# EAGLE design MainBoard (EAGLE 8.2.2)
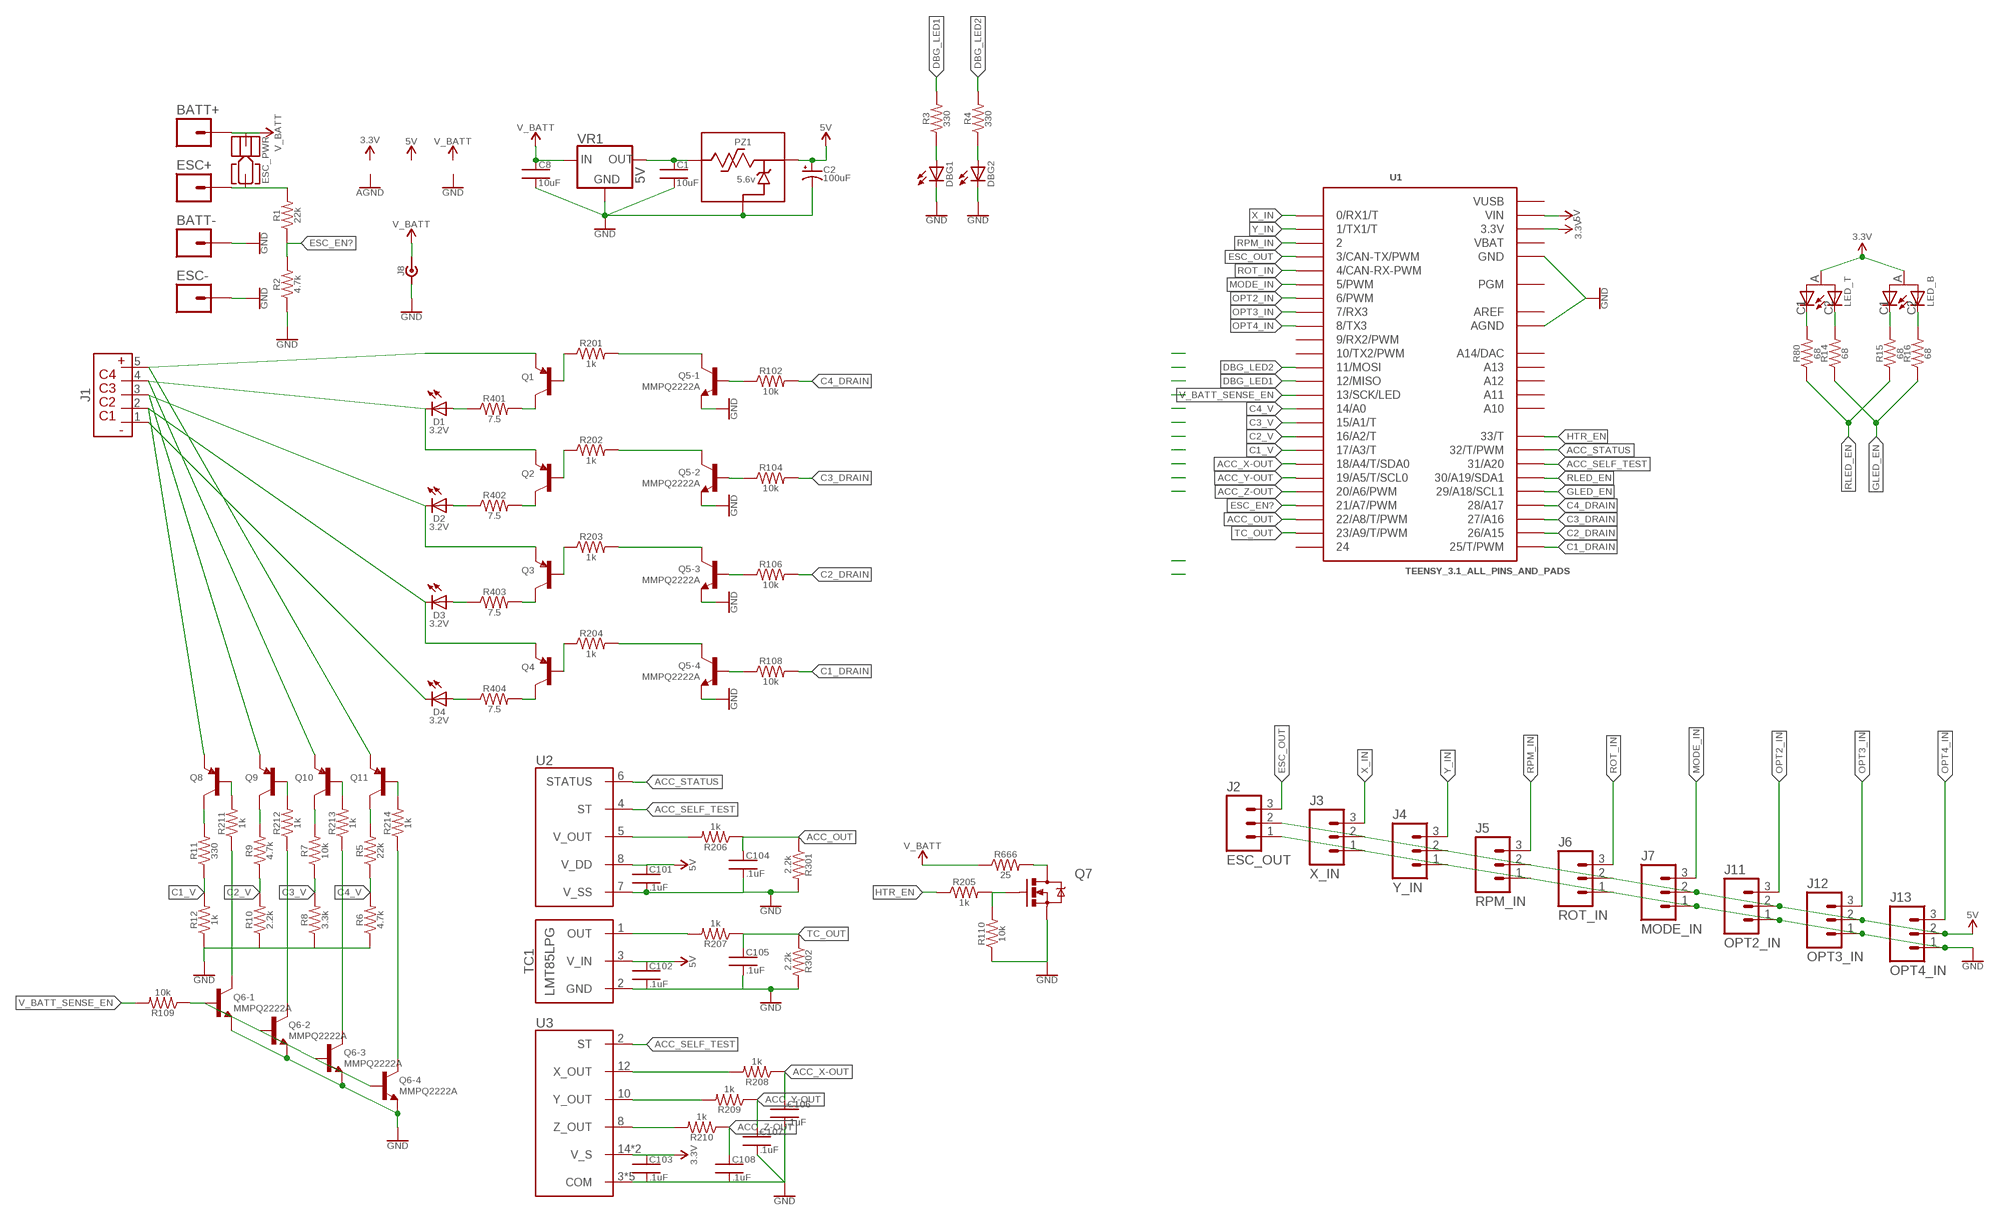
[diagram p0: schematic, sheet 1]

## Parts
BATT+  14AWG  [14AWG_SMD]
BATT-  14AWG  [14AWG_SMD]
C1  10uF  CAP_SMD  [0805]
C2  100uF  CAP_POL_SMD  [2917_D-CASE]
C8  10uF  CAP_SMD  [0805]
C101  .1uF  CAP_SMD  [0805]
C102  .1uF  CAP_SMD  [0805]
C103  .1uF  CAP_SMD  [0805]
C104  .1uF  CAP_SMD  [0805]
C105  .1uF  CAP_SMD  [0805]
C106  .1uF  CAP_SMD  [0805]
C107  .1uF  CAP_SMD  [0805]
C108  .1uF  CAP_SMD  [0805]
D1  3.2V  LED2835  [LED-2835]
D2  3.2V  LED2835  [LED-2835]
D3  3.2V  LED2835  [LED-2835]
D4  3.2V  LED2835  [LED-2835]
DBG1  LED1206  [LED-1206]
DBG2  LED1206  [LED-1206]
ESC+  14AWG  [14AWG_SMD]
ESC-  14AWG  [14AWG_SMD]
ESC_PWR  JACK_PWR_SCREW  [JACK_PWR_SCREW]
J1  BATT_BALANCER_PLUG_4S  [JST_MALE_5_PIN]
J2  ESC_OUT  M03  [1X03]
J3  X_IN  M03  [1X03]
J4  Y_IN  M03  [1X03]
J5  RPM_IN  M03  [1X03]
J6  ROT_IN  M03  [1X03]
J7  MODE_IN  M03  [1X03]
J8  PJ-082BH  [PJ-082BH]
J11  OPT2_IN  M03  [1X03]
J12  OPT3_IN  M03  [1X03]
J13  OPT4_IN  M03  [1X03]
LED_B  DIALIGHT_597-2751-607F  [DIALIGHT_1208_BI-COLOR]
LED_T  DIALIGHT_597-2751-607F  [DIALIGHT_1208_BI-COLOR]
PZ1  5.6v  POLYZEN_LS  [POLYZEN_LS]
Q1  BJT_PNP  [SOT23-3]
Q2  BJT_PNP  [SOT23-3]
Q3  BJT_PNP  [SOT23-3]
Q4  BJT_PNP  [SOT23-3]
Q5  MMPQ2222A  [SOIC_16]
Q6  MMPQ2222A  [SOIC_16]
Q7  MOSFET_N-CHANNEL_SOT23-3  [SOT23-3]
Q8  BJT_PNP  [SOT23-3]
Q9  BJT_PNP  [SOT23-3]
Q10  BJT_PNP  [SOT23-3]
Q11  BJT_PNP  [SOT23-3]
R1  22k  RES_SMD0805  [0805]
R2  4.7k  RES_SMD0805  [0805]
R3  330  RES_SMD0805  [0805]
R4  330  RES_SMD0805  [0805]
R5  22k  RES_SMD0805  [0805]
R6  4.7k  RES_SMD0805  [0805]
R7  10k  RES_SMD0805  [0805]
R8  3.3k  RES_SMD0805  [0805]
R9  4.7k  RES_SMD0805  [0805]
R10  2.2k  RES_SMD0805  [0805]
R11  330  RES_SMD0805  [0805]
R12  1k  RES_SMD0805  [0805]
R14  68  RES_SMD0805  [0805]
R15  68  RES_SMD0805  [0805]
R16  68  RES_SMD0805  [0805]
R80  68  RES_SMD0805  [0805]
R102  10k  RES_SMD0805  [0805]
R104  10k  RES_SMD0805  [0805]
R106  10k  RES_SMD0805  [0805]
R108  10k  RES_SMD0805  [0805]
R109  10k  RES_SMD0805  [0805]
R110  10k  RES_SMD0805  [0805]
R201  1k  RES_SMD0805  [0805]
R202  1k  RES_SMD0805  [0805]
R203  1k  RES_SMD0805  [0805]
R204  1k  RES_SMD0805  [0805]
R205  1k  RES_SMD0805  [0805]
R206  1k  RES_SMD0805  [0805]
R207  1k  RES_SMD0805  [0805]
R208  1k  RES_SMD0805  [0805]
R209  1k  RES_SMD0805  [0805]
R210  1k  RES_SMD0805  [0805]
R211  1k  RES_SMD0805  [0805]
R212  1k  RES_SMD0805  [0805]
R213  1k  RES_SMD0805  [0805]
R214  1k  RES_SMD0805  [0805]
R301  2.2k  RES_SMD0805  [0805]
R302  2.2k  RES_SMD0805  [0805]
R401  7.5  RES_SMD1206  [1206]
R402  7.5  RES_SMD1206  [1206]
R403  7.5  RES_SMD1206  [1206]
R404  7.5  RES_SMD1206  [1206]
R666  25  AP851  [TO-220-R]
TC1  LMT85LPG  [TO-92]
U1  TEENSY_3.1_ALL_PINS_AND_PADS  [TEENSY_3.1_ALLPINS]
U2  MMA1211KEG  [SOIC_16_WIDE]
U3  ADXL326  [LFCSP_LQ]
VR1  5V  TSR_2-XXXX  [TSR_2-XXXX]

## Nets
3.3V: C103.1 LED_B.A LED_T.A U1.3.3V U1.3.3V1(3.3V) U1.3.3V2(3.3V) U3.14(V_S) U3.15(V_S)
5V: C2.A+(+) C101.1 C102.1 J2.2 J3.2 J4.2 J5.2 J6.2 J7.2 J11.2 J12.2 J13.2 PZ1.VOUT(V_OUT) TC1.3(V_IN) U1.VIN U2.8(V_DD)
ACC_OUT: C104.1 R206.1 R301.1 U1.22/A8(22/A8/T/PWM)
ACC_SELF_TEST: U1.31(31/A20) U2.4(ST) U3.2(ST)
ACC_STATUS: U1.32(32/T/PWM) U2.6(STATUS)
ACC_X-OUT: C106.1 R208.1 U1.18/A4(18/A4/T/SDA0)
ACC_Y-OUT: C107.1 R209.1 U1.19/A5(19/A5/T/SCL0)
ACC_Z-OUT: C108.1 R210.1 U1.20/A6(20/A6/PWM)
C1_DRAIN: R108.2 U1.25(25/T/PWM)
C1_V: R11.1 R12.2 U1.17/A3(17/A3/T)
C2_DRAIN: R106.2 U1.26(26/A15)
C2_V: R9.1 R10.2 U1.16/A2(16/A2/T)
C3_DRAIN: R104.2 U1.27(27/A16)
C3_V: R7.1 R8.2 U1.15/A1(15/A1/T)
C4_DRAIN: R102.2 U1.28(28/A17)
C4_V: R5.1 R6.2 U1.14/A0
DBG_LED1: R3.2 U1.12(12/MISO)
DBG_LED2: R4.2 U1.11(11/MOSI)
ESC+: ESC+.P ESC_PWR.1 R1.2
ESC_EN?: R1.1 R2.2 U1.21/A7(21/A7/PWM)
ESC_OUT: J2.3 U1.3(3/CAN-TX/PWM)
GLED_EN: R14.1 R16.1 U1.29(29/A18/SCL1)
GND: BATT-.P C1.2 C2.C-(-) C8.2 C101.2 C102.2 C103.2 C104.2 C105.2 C106.2 C107.2 C108.2 DBG1.C DBG2.C ESC-.P J2.1 J3.1 J4.1 J5.1 J6.1 J7.1 J8.2 J8.SH1 J8.SH2 J8.SH3 J8.SH4 J11.1 J12.1 J13.1 PZ1.GND Q5.10(-4:E) Q5.12(-3:E) Q5.14(-2:E) Q5.16(-1:E) Q6.10(-4:E) Q6.12(-3:E) Q6.14(-2:E) Q6.16(-1:E) Q7.2(S) R2.1 R6.1 R8.1 R10.1 R12.1 R110.1 R301.2 R302.2 TC1.2(GND) U1.AGND U1.GND U1.GND1(GND) U1.GND2(GND) U2.7(V_SS) U3.3(COM) U3.5(COM) U3.6(COM) U3.7(COM) U3.17(COM) VR1.2(GND)
HTR_EN: R205.1 U1.33(33/T)
MODE_IN: J7.3 U1.5(5/PWM)
N$1: D1.A R401.1
N$2: Q1.3(C) R401.2
N$3: Q1.1(B) R201.1
N$4: Q5.1(-1:C) Q5.2(-1:C) R201.2
N$5: J1.5(C4) Q1.2(E) Q11.2(E)
N$6: Q5.15(-1:B) R102.1
N$7: Q7.3(D) R666.2
N$8: D2.A R402.1
N$9: Q2.3(C) R402.2
N$10: Q2.1(B) R202.1
N$11: Q5.3(-2:C) Q5.4(-2:C) R202.2
N$12: D1.C J1.4(C3) Q2.2(E) Q10.2(E)
N$13: Q5.13(-2:B) R104.1
N$14: D3.A R403.1
N$15: Q3.3(C) R403.2
N$16: Q3.1(B) R203.1
N$17: Q5.5(-3:C) Q5.6(-3:C) R203.2
N$18: D2.C J1.3(C2) Q3.2(E) Q9.2(E)
N$19: Q5.11(-3:B) R106.1
N$20: D4.A R404.1
N$21: Q4.3(C) R404.2
N$22: Q4.1(B) R204.1
N$23: Q5.7(-4:C) Q5.8(-4:C) R204.2
N$24: D3.C J1.2(C1) Q4.2(E) Q8.2(E)
N$25: Q5.9(-4:B) R108.1
N$26: D4.C J1.1(V0)
N$27: Q7.1(G) R110.2 R205.2
N$28: R206.2 U2.5(V_OUT)
N$29: Q8.3(C) R11.2
N$30: Q8.1(B) R211.2
N$31: Q6.1(-1:C) Q6.2(-1:C) R211.1
N$32: Q9.1(B) R212.2
N$33: Q6.9(-4:B) Q6.11(-3:B) Q6.13(-2:B) Q6.15(-1:B) R109.1
N$34: R208.2 U3.12(X_OUT)
N$35: R209.2 U3.10(Y_OUT)
N$36: R210.2 U3.8(Z_OUT)
N$37: R207.2 TC1.1(OUT)
N$38: Q6.3(-2:C) Q6.4(-2:C) R212.1
N$39: Q10.3(C) R7.2
N$40: Q10.1(B) R213.2
N$41: Q6.5(-3:C) Q6.6(-3:C) R213.1
N$42: Q11.3(C) R5.2
N$43: Q11.1(B) R214.2
N$44: Q6.7(-4:C) Q6.8(-4:C) R214.1
N$45: Q9.3(C) R9.2
N$48: DBG2.A R4.1
N$49: DBG1.A R3.1
N$50: C1.1 PZ1.VIN(V_IN) VR1.3(OUT)
N$62: LED_T.C1 R80.2
N$63: LED_T.C2 R14.2
N$64: LED_B.C1 R15.2
N$65: LED_B.C2 R16.2
OPT2_IN: J11.3 U1.6(6/PWM)
OPT3_IN: J12.3 U1.7(7/RX3)
OPT4_IN: J13.3 U1.8(8/TX3)
RLED_EN: R15.1 R80.1 U1.30(30/A19/SDA1)
ROT_IN: J6.3 U1.4(4/CAN-RX-PWM)
RPM_IN: J5.3 U1.2
TC_OUT: C105.1 R207.1 R302.1 U1.23/A9(23/A9/T/PWM)
V_BATT: BATT+.P C8.1 ESC_PWR.2 J8.1 R666.1 VR1.1(IN)
V_BATT_SENSE_EN: R109.2 U1.13(13/SCK/LED)
X_IN: J3.3 U1.0(0/RX1/T)
Y_IN: J4.3 U1.1(1/TX1/T)
Unconnected: U1.9(9/RX2/PWM) U1.10(10/TX2/PWM) U1.24 U1.A10 U1.A11 U1.A12 U1.A13 U1.A14(A14/DAC) U1.PGM

## Power pins joined to a net without a drawn wire
AREF: U1.AREF
VBAT: U1.VBAT
VUSB: U1.VUSB

## Library data of the parts
BATT+ BATT- ESC+ ESC- = jack_connector:14AWG
C1 C8 C101-C108 = jack_RCL:CAP_SMD
C2 = jack_RCL:CAP_POL_SMD
D1-D4 DBG1 DBG2 = jack_led:LED
ESC_PWR = jack_connector:JACK_PWR_SCREW
J1 = jack_connector:BATT_BALANCER_PLUG_4S
J2-J7 J11-J13 = jack_connector:M03
J8 = jack_connector:PJ-082BH: 2.5mm X 5.5mm Barrel Jack 10A https://www.mouser.com/productdetail/cui/pj-082bh?qs=sGAEpiMZZMtnOp%252bbbqA009lE0K0K%252bPZGlcfi0IIywdBXw6pUdVh2jw%3D%3D
LED_B LED_T = jack_led:DIALIGHT_597-2751-607F
PZ1 = jack_IC:POLYZEN: https://www.mouser.com/ds/2/240/Littelfuse_PolyZen_Standard_PolyZen_Catalog_Datash-1021770.pdf
Q1-Q4 Q8-Q11 = jack_semi:BJT_PNP: Generic NPN Bipolar transistor
Q5 Q6 = jack_semi:MMPQ2222A: Quad 500mA 40v NPN transistor package https://www.mouser.com/productdetail/on-semiconductor-fairchild/mmpq2222a?qs=sGAEpiMZZMshyDBzk1%2FWi8oN7VHZ91Okw9HzP%2FjA8dg%3D
Q7 = jack_semi:MOSFET_N-CHANNEL
R1-R12 R14-R16 R80 R102 R104 R106 R108-R110 R201-R214 R301 R302 R401-R404 = jack_RCL:RES_SMD
R666 = jack_RCL:AP851: TO-220 50W Resistor http://www.mouser.com/ds/2/303/acl_ap851-1228646.pdf
TC1 = jack_IC:LMT85: LMT85 Analog Temperature Sensor -50C to 150C, 1.8V-5.5V Vin Texas Instruments http://www.ti.com/lit/ds/symlink/lmt85.pdf
U1 = jack_IC:TEENSY_3.1_ALL_PINS_AND_PADS: Footprint for Teensy 3.1 board using all pads and all through-holes. Pads need a 2x7 0.1" SMD header.
U2 = jack_IC:MMA1211KEG
U3 = jack_IC:ADXL326
VR1 = jack_IC:TSR_2-XXXX: TRACO Power 2A step down converter http://www.mouser.com/ds/2/687/tsr2-datasheet-911338.pdf

## Board
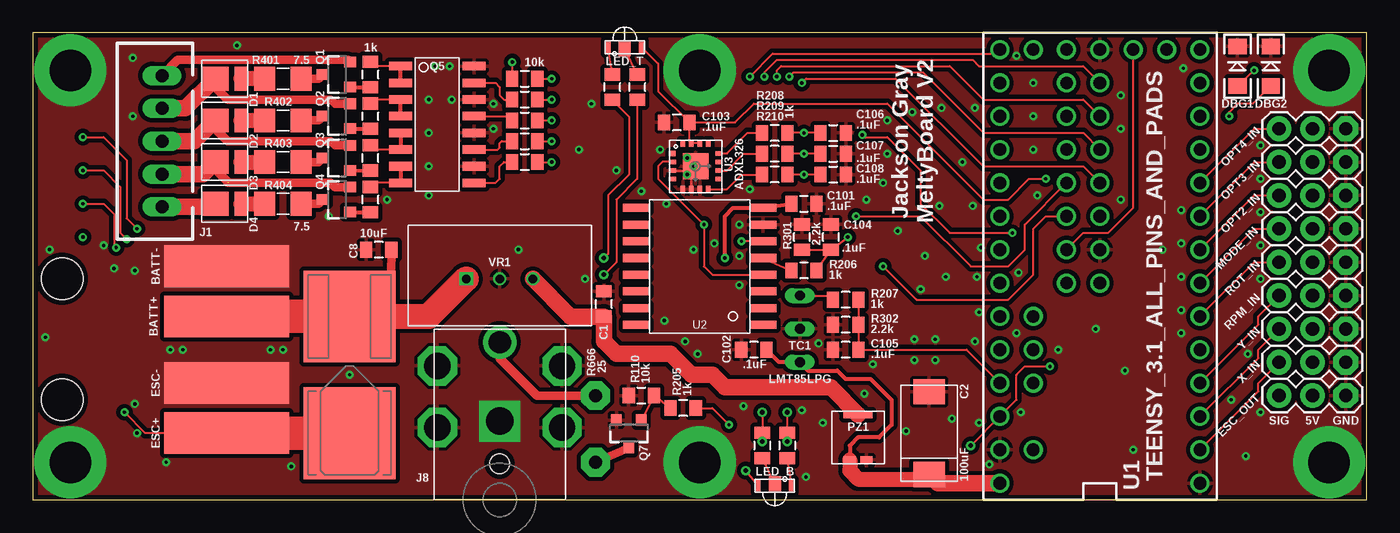
[diagram p1: board, top side]
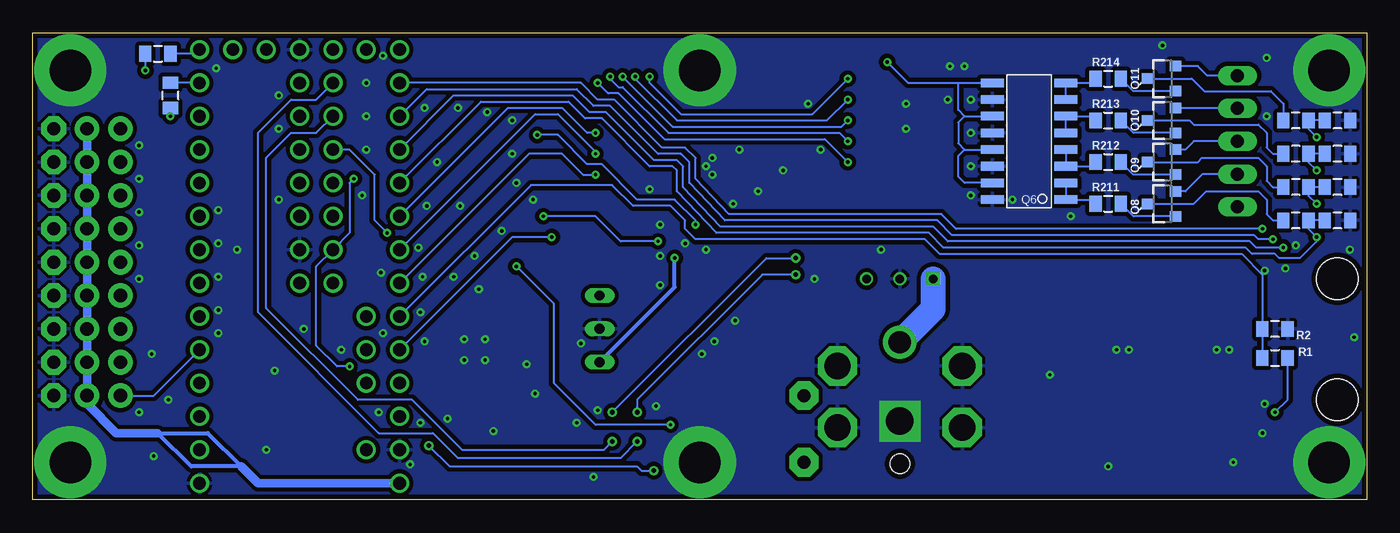
[diagram p2: board, bottom side, seen from below]

Size 101.6 x 35.56 mm. Coordinates in mm from the lower left corner, seen from the top.
Outline: 0,0 101.6,0 101.6,35.56 0,35.56 0,0
Copper layers (1*16): Top 0.0356mm / dielectric 1.5011mm / Bottom 0.0356mm
Design rules "oshpark-2layer *": minimum track width 6mil, minimum drill 10mil, track to track 6mil, track to pad 6mil, pad to pad 6mil, via to via 6mil, smd to smd 6mil, copper to edge 15mil, drill to drill 6mil, minimum pad ring 7mil, minimum via ring 7mil, stop-mask expansion 2.5mil, vias tented up to drill 11mil, thermal gap 10mil
Holes 3.17 mm at 2.22,16.83 2.22,7.62

### Footprints (pad centres in the part's own frame; a part is rotated, then mirrored left to right if it is on the bottom)
14AWG_SMD = smd 9.525 x 3.175: P 0,0
0805 = smd 0.927 x 1.2: 1 -0.964,0; 2 0.964,0
2917_D-CASE = smd 1.905 x 2.388: A+ -3.15,0; C- 3.15,0
LED-2835 = smd 0.99 x 1.8: A 1.255,0 | smd 2.06 x 1.8: C -0.72,0
LED-1206 = smd 1.2 x 1.4: A -1.5,0; C 1.5,0
JACK_PWR_SCREW = smd 6.985 x 6.985: 1 0,4.445; 2 0,-4.445
JST_MALE_5_PIN = drill 1 long: 1 5,0; 2 2.5,0; 3 0,0; 4 -2.5,0; 5 -5,0
1X03 = drill 1.016 pad 1.88 octagon: 1 0,0 | drill 1.016 pad 1.88: 2 2.54,0; 3 5.08,0
PJ-082BH = drill 1.7: 1 12,0 | drill 2.1 square: 2 6,0 | drill 2 octagon: SH1 5.5,4.75; SH2 10.2,4.75; SH3 5.5,-4.75; SH4 10.2,-4.75 | hole 1.5: 2.75,0
DIALIGHT_1208_BI-COLOR = smd 0.406 x 0.991: A -1.295,-0.495; C1 1.295,-0.495 | smd 0.914 x 1.143: C2 0,-0.381
POLYZEN_LS = smd 0.56 x 0.94: GND 1.72,0.635; VOUT 1.72,-0.635 | smd 0.56 x 2.21: VIN -1.72,0
SOT23-3 = smd 0.8 x 0.9: 1 -0.95,-1; 2 0.95,-1; 3 0,1.1
SOIC_16 = smd 1.75 x 0.65: 1 -2.8,4.445; 2 -2.8,3.175; 3 -2.8,1.905; 4 -2.8,0.635; 5 -2.8,-0.635; 6 -2.8,-1.905; 7 -2.8,-3.175; 8 -2.8,-4.445; 9 2.8,-4.445; 10 2.8,-3.175; 11 2.8,-1.905; 12 2.8,-0.635; 13 2.8,0.635; 14 2.8,1.905; 15 2.8,3.175; 16 2.8,4.445
1206 = smd 1.6 x 1.8: 1 -1.4,0; 2 1.4,0
TO-220-R = drill 1 pad 2.184 octagon: 1 0,-2.54; 2 0,2.54
TO-92 = drill 0.75 pad 1.07 long: 1 -2.54,0; 2 0,0; 3 2.54,0
TEENSY_3.1_ALLPINS = drill 0.965: 0 -7.62,15.24; 1 -7.62,12.7; 2 -7.62,10.16; 3 -7.62,7.62; 3.3V 7.62,12.7; 3.3V1 -2.54,-15.24; 3.3V2 2.54,0; 4 -7.62,5.08; 5 -7.62,2.54; 6 -7.62,0; 7 -7.62,-2.54; 8 -7.62,-5.08; 9 -7.62,-7.62; 10 -7.62,-10.16; 11 -7.62,-12.7; 12 -7.62,-15.24; 13 7.62,-15.24; 14/A0 7.62,-12.7; 15/A1 7.62,-10.16; 16/A2 7.62,-7.62; 17/A3 7.62,-5.08; 18/A4 7.62,-2.54; 19/A5 7.62,0; 20/A6 7.62,2.54; 21/A7 7.62,5.08; 22/A8 7.62,7.62; 23/A9 7.62,10.16; 24 0,-2.54; 25 0,-5.08; 26 0,-7.62; 27 0,-10.16; 28 0,-12.7; 29 2.54,-12.7; 30 2.54,-10.16; 31 2.54,-7.62; 32 2.54,-5.08; 33 2.54,-2.54; A10 5.08,7.62; A11 5.08,5.08; A12 0,2.54; A13 2.54,2.54; A14 5.08,-15.24; AGND 7.62,15.24; AREF 5.08,10.16; GND -7.62,17.78; GND1 0,-15.24; GND2 0,0; PGM 2.54,-15.24; VBAT -5.08,-15.24; VIN 7.62,17.78; VUSB 5.08,15.24
SOIC_16_WIDE = smd 2.032 x 0.61: 1 -4.826,4.445; 2 -4.826,3.175; 3 -4.826,1.905; 4 -4.826,0.635; 5 -4.826,-0.635; 6 -4.826,-1.905; 7 -4.826,-3.175; 8 -4.826,-4.445; 9 4.826,-4.445; 10 4.826,-3.175; 11 4.826,-1.905; 12 4.826,-0.635; 13 4.826,0.635; 14 4.826,1.905; 15 4.826,3.175; 16 4.826,4.445
LFCSP_LQ = smd 0.5 x 0.35: 1 -1.75,0.975; 2 -1.75,0.325; 3 -1.75,-0.325; 4 -1.75,-0.975; 9 1.75,-0.975; 10 1.75,-0.325; 11 1.75,0.325; 12 1.75,0.975 | smd 0.35 x 0.5: 5 -0.975,-1.75; 6 -0.325,-1.75; 7 0.325,-1.75; 8 0.975,-1.75; 13 0.975,1.75; 14 0.325,1.75; 15 -0.325,1.75; 16 -0.975,1.75 | smd 1.95 x 1.95: 17 0,0
TSR_2-XXXX = drill 0.645 square: 1 -2.54,0 | drill 0.645: 2 0,0; 3 2.54,0

### Placement (x,y rotation side)
BATT+  14.76,13.97 0 top
BATT-  14.76,17.78 0 top
C1  43.5,14.92 90 top
C2  68.26,5.08 90 top
C8  26.35,19.05 180 top
C101  58.74,22.54 0 top
C102  54.93,11.43 180 top
C103  49.05,28.73 180 top
C104  60.8,20 90 top
C105  61.91,11.43 180 top
C106  60.96,27.94 0 top
C107  60.96,26.35 0 top
C108  60.96,24.77 0 top
D1  14.61,32.07 0 top
D2  14.61,28.89 0 top
D3  14.61,25.72 0 top
D4  14.61,22.54 0 top
DBG1  91.76,33.02 90 top
DBG2  94.3,33.02 90 top
ESC+  14.76,5.08 0 top
ESC-  14.76,8.89 0 top
ESC_PWR  24.13,9.53 180 top
J1  9.84,27.3 270 top
J2  100.01,7.94 180 top
J3  100.01,10.48 180 top
J4  100.01,13.02 180 top
J5  100.01,15.56 180 top
J6  100.01,18.1 180 top
J7  100.01,20.64 180 top
J8  35.56,0 90 top
J11  100.01,23.18 180 top
J12  100.01,25.72 180 top
J13  100.01,28.26 180 top
LED_B  56.52,1.59 0 top
LED_T  45.09,33.97 180 top
PZ1  62.87,4.76 270 top
Q1  23.18,32.38 90 top
Q2  23.18,29.21 90 top
Q3  23.18,26.04 90 top
Q4  23.18,22.86 90 top
Q5  30.8,28.57 0 top
Q6  25.72,27.3 180 bottom
Q7  45.4,5.08 180 top
Q8  15.56,22.54 90 bottom
Q9  15.56,25.72 90 bottom
Q10  15.56,28.89 90 bottom
Q11  15.56,32.07 90 bottom
R1  6.99,10.79 0 bottom
R2  6.99,13.02 180 bottom
R3  92.08,33.97 0 bottom
R4  91.12,30.8 90 bottom
R5  5.4,28.89 180 bottom
R6  2.22,28.89 180 bottom
R7  5.4,26.35 180 bottom
R8  2.22,26.35 180 bottom
R9  5.4,23.81 180 bottom
R10  2.22,23.81 180 bottom
R11  5.4,21.27 180 bottom
R12  2.22,21.27 180 bottom
R14  46.04,31.42 90 top
R15  57.47,4.14 270 top
R16  55.56,4.14 270 top
R80  44.13,31.42 90 top
R102  37.47,30.48 0 top
R104  37.47,28.89 0 top
R106  37.47,27.3 0 top
R108  37.47,25.72 0 top
R109  37.47,32.07 0 top
R110  46.35,7.94 0 top
R201  25.72,32.38 90 top
R202  25.72,29.21 90 top
R203  25.72,26.04 90 top
R204  25.72,22.86 90 top
R205  49.53,6.99 180 top
R206  58.74,17.46 180 top
R207  61.91,15.24 180 top
R208  56.52,27.94 180 top
R209  56.52,26.35 180 top
R210  56.52,24.77 180 top
R211  19.68,22.54 0 bottom
R212  19.68,25.72 0 bottom
R213  19.68,28.89 0 bottom
R214  19.68,32.07 0 bottom
R301  58.58,20 90 top
R302  61.91,13.34 180 top
R401  19.05,32.07 0 top
R402  19.05,28.89 0 top
R403  19.05,25.72 0 top
R404  19.05,22.54 0 top
R666  42.86,5.4 180 top
TC1  58.42,13.02 270 top
U1  81.28,19.05 180 top
U2  50.8,17.78 180 top
U3  50.48,25.4 0 top
VR1  35.56,16.83 0 top

### Tracks (layer width: path | path; a pad name or v marks a point on that pad's centre or on a via)
3.3V  (via drill 0.25, 0.35)
  Top 0.159: U3.14 U3.15 50.02,27.29 C103.1 | U1.3.3V2 80.01,20.32 81.92,20.32 83.82,22.23 U1.3.3V1 | v77.15,24.45 75.88,24.45 74.3,22.86 72.39,22.86 65.09,30.16 54.93,30.16 53.5,28.73 C103.1 | C103.1 47.64,31.11 47.62,31.11 47.62,33.22 LED_T.A | v71.44,4.13 U1.3.3V 74.93,7.62 74.93,9.53 75.56,10.16 v77.47,10.16 | v54.29,2.22 LED_B.A
  Bottom 0.159: v77.47,10.16 78.42,10.16 80.01,11.75 80.01,17.78 U1.3.3V2 77.47,20.32 77.47,24.13 v77.15,24.45 | v71.44,4.13 69.85,2.54 55.56,2.54 55.24,2.22 v54.29,2.22
5V  (via drill 0.25)
  Top 0.152: 58.4,10.48 TC1.3
  Top 0.318: C101.1 U2.8 53.34,22.23 52.7,21.59 v52.7,18.41 | TC1.3 56.84,10.48 C102.1 | TC1.3 | TC1.3 59.05,9.84 61.28,9.84 61.91,9.21 63.82,9.21 65.41,7.62 65.41,5.71 64.45,4.76 62.87,4.76 62.23,4.13 PZ1.VOUT
  Top 1.143: PZ1.VOUT 62.23,2.22 62.87,1.59 67.92,1.59 C2.A+
  Top 1.27: C2.A+ 68.92,1.27 U1.VIN
  Bottom 0.318: TC1.3 52.7,16.19 v52.7,18.41 | 85.72,2.54 89.53,2.54 92.08,5.08 88.27,5.08 85.72,2.54
  Bottom 0.635: U1.VIN 84.45,1.27 85.72,2.54 | 92.08,5.08 95.25,5.08 97.47,7.3 J2.2 J3.2 J4.2 J5.2 J6.2 J7.2 J11.2 J12.2 J13.2
ACC_OUT  (via drill 0.25)
  Top 0.159: R206.1 C104.1 | R301.1 C104.1 | C104.1 v62.07,20
  Bottom 0.159: v62.07,20 65.09,20 U1.22/A8
ACC_SELF_TEST  (via drill 0.25)
  Top 0.159: U2.4 51.75,17.14 51.12,17.78 v51.12,20.95 47.62,24.45 47.62,25.4 47.95,25.73 U3.2 | v63.18,27.78 63.34,27.62 65.09,27.62 67.63,25.08 67.63,22.54 69.85,20.32 v74.61,20.32
  Bottom 0.159: v51.12,20.95 51.12,21.27 52.7,22.86 55.56,22.86 58.26,25.56 59.37,25.56 61.59,27.78 v63.18,27.78 | v74.61,20.32 75.56,21.27 75.56,24.77 77.47,26.67 U1.31
ACC_STATUS  (via drill 0.25)
  Top 0.159: U2.6 v53.98,19.68 | v62.71,21.59 67.63,21.59 71.44,17.78 74.3,17.78 75.56,19.05 75.56,20.95 U1.32
  Bottom 0.159: v53.98,19.68 56.83,19.68 58.74,21.59 v62.71,21.59
ACC_X-OUT  (via drill 0.25)
  Top 0.159: R208.1 v58.74,27.94 C106.1
  Bottom 0.159: v58.74,27.94 59.37,27.94 61.28,29.84 65.41,29.84 U1.18/A4
ACC_Y-OUT  (via drill 0.25)
  Top 0.159: R209.1 v58.74,26.35 C107.1
  Bottom 0.159: v58.74,26.35 58.74,26.51 61.59,29.37 63.34,29.37 U1.19/A5
ACC_Z-OUT  (via drill 0.25)
  Top 0.159: R210.1 v58.74,24.77 C108.1
  Bottom 0.159: v58.74,24.77 59.69,24.77 61.28,26.35 63.82,26.35 U1.20/A6
C1_DRAIN  (via drill 0.25)
  Top 0.159: v58.58,31.75 58.9,32.07 65.72,32.07 72.39,25.4 80.01,25.4 U1.25 | R108.2 v39.53,25.72
  Bottom 0.159: v58.58,31.75 57.78,30.96 56.99,30.96 53.5,27.46 41.27,27.46 v39.53,25.72
C1_V  (via drill 0.25)
  Bottom 0.159: U1.17/A3 67.47,30.32 60.8,30.32 59.53,29.05 58.26,29.05 54.61,25.4 52.86,25.4 52.55,25.08 52.55,23.5 49.53,20.32 33.34,20.32 32.23,19.21 9.21,19.21 8.73,18.73 6.99,18.73 6.67,18.41 5.08,18.41 3.81,19.68 v3.81,20 4.43,20.63 R11.1 R12.2
C2_DRAIN  (via drill 0.25)
  Top 0.159: v57.63,32.23 57.94,32.54 67.79,32.54 72.39,27.94 80.01,27.94 U1.26 | R106.2 v39.53,27.3
  Bottom 0.159: v57.63,32.23 57.63,32.07 56.99,31.43 56.67,31.43 53.18,27.94 40.16,27.94 v39.53,27.3
C2_V  (via drill 0.25)
  Top 0.159: v3.81,22.54 5.4,22.54 6.19,21.75 6.19,19.37 v6.35,19.21
  Bottom 0.159: 60.48,30.79 59.21,29.53 57.94,29.53 54.29,25.88 52.55,25.88 52.07,25.4 52.07,23.81 49.21,20.8 33.02,20.8 31.91,19.68 8.89,19.68 8.41,19.21 v6.35,19.21 | 60.48,30.79 60.48,30.8 | U1.16/A2 69.54,30.79 60.48,30.79 | R10.2 R9.1 4.43,23.17 v3.81,22.54
C3_DRAIN  (via drill 0.25)
  Top 0.159: v56.67,32.23 56.67,32.7 56.99,33.02 69.85,33.02 72.39,30.48 80.01,30.48 U1.27 | R104.2 v39.53,28.89
  Bottom 0.159: v56.67,32.23 52.86,28.42 40.01,28.42 v39.53,28.89
C3_V  (via drill 0.25)
  Top 0.159: v3.81,25.08 5.4,25.08 6.67,23.81 6.67,20.32 v7.14,19.84
  Bottom 0.159: U1.15/A1 71.6,31.27 60.17,31.27 58.9,30 57.63,30 53.98,26.35 52.23,26.35 51.59,25.72 51.59,24.13 48.9,21.27 32.7,21.27 31.59,20.16 8.57,20.16 8.26,19.84 v7.14,19.84 | R8.2 R7.1 4.43,25.71 v3.81,25.08
C4_DRAIN  (via drill 0.25)
  Top 0.159: v55.72,32.23 55.72,32.54 56.67,33.5 71.6,33.5 72.07,33.02 80.01,33.02 U1.28 | R102.2 v39.53,30.48
  Bottom 0.159: v55.72,32.23 55.72,32.07 52.55,28.89 41.12,28.89 v39.53,30.48
C4_V  (via drill 0.25)
  Top 0.159: v3.81,27.62 5.4,27.62 7.14,25.88 7.14,21.43 v7.94,20.64
  Bottom 0.159: U1.14/A0 59.85,31.75 58.58,30.48 57.31,30.48 53.66,26.83 51.91,26.83 51.12,26.04 51.12,24.45 48.58,21.75 32.38,21.75 31.27,20.64 v7.94,20.64 | R6.2 R5.1 4.43,28.25 v3.81,27.62
DBG_LED1
  Bottom 0.159: U1.12 89.22,33.97 R3.2
DBG_LED2
  Bottom 0.159: U1.11 R4.2
ESC+  (via drill 0.25)
  Top 0.159: ESC+.P 8.57,5.08 v6.99,6.67
  Top 2.54: ESC_PWR.1 ESC+.P
  Bottom 0.159: v6.99,6.67 6.02,7.63 R1.2
ESC_EN?
  Bottom 0.159: U1.21/A7 63.66,23.97 57.47,23.97 55.88,22.38 53.02,22.38 51.91,21.27 51.91,20.64 51.12,19.84 33.66,19.84 32.54,18.73 9.53,18.73 7.95,17.16 R2.2 R1.1
ESC_OUT
  Bottom 0.159: J2.3 92.39,7.94 U1.3
GLED_EN  (via drill 0.35)
  Top 0.159: v55.56,4.45 R16.1 v55.56,6.67 | R14.1 46.04,24.45 44.45,22.86 44.45,18.1 v43.5,17.14
  Bottom 0.159: U1.29 80.01,30.48 81.92,30.48 84.45,27.94 84.45,14.29 75.25,5.08 71.12,5.08 69.22,3.17 56.83,3.17 v55.56,4.45 | v43.5,17.14 46.04,17.14 55.56,7.62 v55.56,6.67
GND  (via drill 0.25, 3.15 pad 5.5)
  Top 0.159: U3.3 50.16,25.07 | U3.6 50.16,25.07 | 50.16,25.07 U3.17
  other vias: 2.86,32.7 2.86,2.86 50.8,32.7 50.8,2.86 98.74,2.86 98.74,32.7 26.99,22.86 15.56,34.61 1.27,19.05 30.16,27.94 7.62,29.21 22.54,21.59 7.62,33.66 5.4,19.37 30.16,30.48 30.64,33.02 31.75,33.02 30.16,25.4 74.93,33.81 87.63,32.86 65.09,28.89 72.07,14.29 65.09,26.35 72.23,19.21 71.6,22.38 54.61,23.65 53.82,20.95 53.82,18.57 51.91,19.53 53.82,16.35 86.04,19.05 78.11,11.43 72.07,5.87 31.91,30.48 41.59,26.67 42.55,30.16 49.85,26.04 49.85,24.77 50.32,25.4 63.5,22.86 64.77,24.13 69.06,22.38 65.88,20.48 67.94,18.57 75.09,17.3 71.91,16.99 69.53,16.99 71.75,12.06 67.15,12.22 68.74,10.64 68.74,12.22 67.15,10.64 92.39,3.33 87.47,12.7 93.5,24.45 87.47,22.07 87.47,16.99 87.47,19.53 87.47,14.45 7.78,17.46 6.19,17.62 7.94,5.08 7.78,7.3 47.78,26.67 50.32,19.05 48.26,22.54 30.16,23.18 83.82,3.81 82.87,22.86 82.87,30.8 82.87,28.26 76.2,26.67 76.2,29.21 76.2,31.75 76.52,23.18 75.25,6.67 67.63,16.03 74.93,12.7 80.96,13.02 70.8,25.72 69.22,29.84 71.75,29.84 83.19,9.84 36.99,19.05 50.64,11.11 35.08,30.16 35.08,28.26 10.16,2.86 0.95,12.38 24.13,9.53 19.05,11.43 18.1,11.43 10.48,11.43 11.43,11.43 19.68,2.54 93.5,26.99 93.5,21.91 93.5,19.37 93.5,16.83 92.55,11.11 91.28,7.62 93.5,6.67 72.87,2.7 70.01,6.19 66.52,5.24 59.85,11.91 63.98,10.32 54.13,7.14 58.58,6.83 63.34,8.1 60.17,5.87 58.9,1.75 46.35,23.5 44.45,25.08 48.1,13.65 49.69,12.06 42.07,16.83 66.99,29.53
  pour Bottom (isolate 0.318): -5.08,-5.08 -5.08,40.64 106.68,40.64 106.68,-5.08
  pour Top (isolate 0.318): -2.54,-2.54 -2.54,38.1 104.14,38.1 104.14,-2.54
HTR_EN  (via drill 0.25)
  Top 0.159: R205.1 51.75,6.99 v53.02,5.71 | v64.77,17.78 67.31,15.24 74.3,15.24 76.2,17.14 76.2,20.64 77.15,21.59 U1.33
  Bottom 0.159: v53.02,5.71 58.74,5.71 61.91,8.89 61.91,14.92 v64.77,17.78
MODE_IN
  Top 0.159: U1.5 93.03,20.64 J7.3
N$1
  Top 1.143: R401.1 D1.A
N$2
  Top 0.635: R401.2 21.76,32.07 Q1.3
N$3
  Top 0.318: Q1.1 R201.1
N$4
  Top 0.159: Q5.1 26.05,33.02 R201.2
  Top 0.318: Q5.2 Q5.1
N$5
  Top 0.635: J1.5 11.03,33.5 24.02,33.5 Q1.2
  Bottom 0.159: J1.5 12.14,32.3 12.86,33.02 Q11.2
N$6
  Top 0.159: Q5.15 35.24,31.75 35.56,31.43 35.56,30.8 35.88,30.48 R102.1
N$7
  Top 0.635: R666.2 Q7.3
N$8
  Top 1.143: D2.A R402.1
N$9
  Top 0.635: R402.2 21.76,28.89 Q2.3
N$10
  Top 0.318: Q2.1 R202.1
N$11
  Top 0.159: Q5.3 26.02,30.48 R202.2
  Top 0.318: Q5.4 Q5.3
N$12
  Top 0.635: Q2.2 23.02,30.16 22.7,30.48 14.84,30.48 13.88,31.43 D1.C
  Top 1.27: D1.C 11.62,29.8 J1.4
  Bottom 0.159: J1.4 14.52,29.8 Q10.2
N$13
  Top 0.159: Q5.13 36.18,29.21 R104.1
N$14
  Top 1.143: D3.A R403.1
N$15
  Top 0.635: R403.2 21.76,25.72 Q3.3
N$16
  Top 0.318: Q3.1 R203.1
N$17
  Top 0.159: Q5.6 26.05,26.67 R203.2
  Top 0.318: Q5.5 Q5.6
N$18
  Top 0.635: Q3.2 23.02,26.98 22.7,27.3 14.84,27.3 13.88,28.26 D2.C
  Top 1.27: D2.C 12.3,27.3 J1.3
  Bottom 0.159: J1.3 13.18,27.3 13.81,26.67 Q9.2
N$19
  Top 0.159: Q5.11 35.4,26.67 35.56,26.83 35.56,27.15 35.72,27.3 R106.1
N$20
  Top 1.143: D4.A R404.1
N$21
  Top 0.635: R404.2 21.76,22.54 Q4.3
N$22
  Top 0.318: Q4.1 R204.1
N$23
  Top 0.159: Q5.8 26.02,24.13 R204.2
  Top 0.318: Q5.7 Q5.8
N$24  (1 unrouted)
  Top 0.635: Q4.2 23.02,23.81 22.7,24.13 14.84,24.13 | 14.92,24.13 13.88,25.17 D3.C
  Top 1.27: D3.C 12.97,24.8 J1.2
  Bottom 0.159: J1.2 12.5,24.8 13.81,23.5 Q8.2
N$25
  Top 0.159: Q5.9 35.24,24.13 35.56,24.45 35.56,25.4 35.88,25.72 R108.1
N$26
  Top 1.27: D4.C 13.65,22.3 J1.1
N$27
  Top 0.159: Q7.1 R110.2 R205.2
N$28
  Top 0.159: U2.5 R206.2
N$29
  Bottom 0.159: Q8.3 13.18,22.54 12.22,23.5 8.26,23.5 7.62,22.86 7.62,21.75 7.14,21.27 R11.2
N$30
  Bottom 0.159: Q8.1 17.77,21.59 R211.2
N$31
  Bottom 0.159: Q6.2 Q6.1 20.97,22.86 R211.1
N$32
  Bottom 0.159: Q9.1 17.77,24.77 R212.2
N$33  (via drill 0.25)
  Top 0.159: v36.51,33.34 36.51,32.08 R109.1
  Bottom 0.159: v36.51,33.34 34.92,31.75 31.11,31.75 | Q6.15 30.64,24.13 31.11,24.61 31.11,26.19 30.64,26.67 | 30.64,26.67 Q6.13 | 30.64,29.21 Q6.11 | 30.64,29.21 31.11,28.73 31.11,27.15 30.64,26.67 | 31.11,31.75 31.11,29.69 30.64,29.21 | 31.11,31.75 Q6.9
N$34
  Top 0.159: U3.12 52.89,26.38 54.45,27.94 R208.2
N$35
  Top 0.159: U3.10 52.86,25.07 54.13,26.35 R209.2
N$36
  Top 0.159: U3.8 52.86,23.65 53.98,24.77 R210.2
N$37
  Top 0.152: TC1.1 60.63,15.56 R207.2
N$38
  Bottom 0.159: Q6.4 Q6.3 20.97,25.4 R212.1
N$39
  Bottom 0.159: Q10.3 13.49,28.89 13.18,28.57 8.26,28.57 7.62,27.94 7.62,26.83 7.14,26.35 R7.2
N$40
  Bottom 0.159: Q10.1 17.77,27.94 R213.2
N$41
  Bottom 0.159: R213.1 20.97,29.21 Q6.6 Q6.5
N$42
  Bottom 0.159: Q11.3 13.34,32.07 12.38,31.11 7.3,31.11 6.35,30.16 6.35,28.9 R5.2
N$43
  Bottom 0.159: Q11.1 17.77,31.12 R214.2
N$44
  Bottom 0.159: Q6.7 Q6.8 20.97,31.75 R214.1
N$45
  Bottom 0.159: Q9.3 12.86,25.72 12.54,26.04 8.26,26.04 7.62,25.4 7.62,24.29 7.14,23.81 R9.2
N$48  (via drill 0.25)
  Top 0.159: DBG2.A 92.94,30.16 91.76,30.16 91.12,29.53 v91.12,29.21
  Bottom 0.159: R4.1 v91.12,29.21
N$49  (via drill 0.25)
  Top 0.159: v93.03,32.7 DBG1.A
  Bottom 0.159: R3.1 93.03,33.96 v93.03,32.7
N$50
  Top 1.27: VR1.3 40.97,13.96 C1.1 43.5,12.06 44.45,11.11 48.58,11.11 50.16,9.53 51.75,9.53 52.7,8.57 60.77,8.57 PZ1.VIN
N$62
  Top 0.159: LED_T.C1 R80.2
N$63
  Top 0.159: LED_T.C2 R14.2
N$64
  Top 0.159: LED_B.C1 R15.2
N$65
  Top 0.159: LED_B.C2 R16.2
OPT2_IN
  Top 0.159: U1.6 93.03,23.18 J11.3
OPT3_IN
  Top 0.159: U1.7 93.03,25.72 J12.3
OPT4_IN
  Top 0.159: U1.8 93.03,28.26 J13.3
RLED_EN  (via drill 0.35)
  Top 0.159: 57.81,4.76 R15.1 | R15.1 v57.47,4.45 | R80.1 45.4,29.19 45.4,24.77 43.81,23.18 43.81,18.73 v43.5,18.41 | R15.1 v57.47,6.67
  Bottom 0.159: U1.30 80.01,27.94 81.92,27.94 83.82,26.04 83.82,14.61 76.83,7.62 72.71,7.62 68.9,3.81 58.1,3.81 v57.47,4.45 | v57.47,6.67 45.72,18.41 v43.5,18.41
ROT_IN
  Top 0.159: U1.4 93.03,18.1 J6.3
RPM_IN
  Top 0.159: U1.2 93.34,13.34 93.34,13.97 J5.3
TC_OUT
  Top 0.152: R207.1 R302.1 C105.1
  Top 0.159: C105.1 71.12,11.43 U1.23/A9
V_BATT
  Top 0.635: R666.1 38.42,7.94 35.56,10.79 J8.1 | C8.1 27.3,17.14 ESC_PWR.2
  Top 1.27: ESC_PWR.2
  Top 1.905: ESC_PWR.2 30.16,13.97 VR1.1
  Top 2.54: BATT+.P ESC_PWR.2
  Bottom 1.905: J8.1 33.02,14.54 VR1.1
V_BATT_SENSE_EN  (via drill 0.25)
  Top 0.159: v54.61,32.23 56.36,33.97 73.34,33.97 U1.13 | R109.2 v39.53,32.07
  Bottom 0.159: v54.61,32.23 54.61,31.75 52.23,29.37 42.23,29.37 v39.53,32.07
X_IN
  Top 0.159: U1.0 93.34,8.26 93.34,8.89 J3.3
Y_IN
  Top 0.159: U1.1 93.34,10.79 93.34,11.43 J4.3

### Text on the board
tPlace: Jackson Gray / MeltyBoard V2 | SIG | 5V | GND